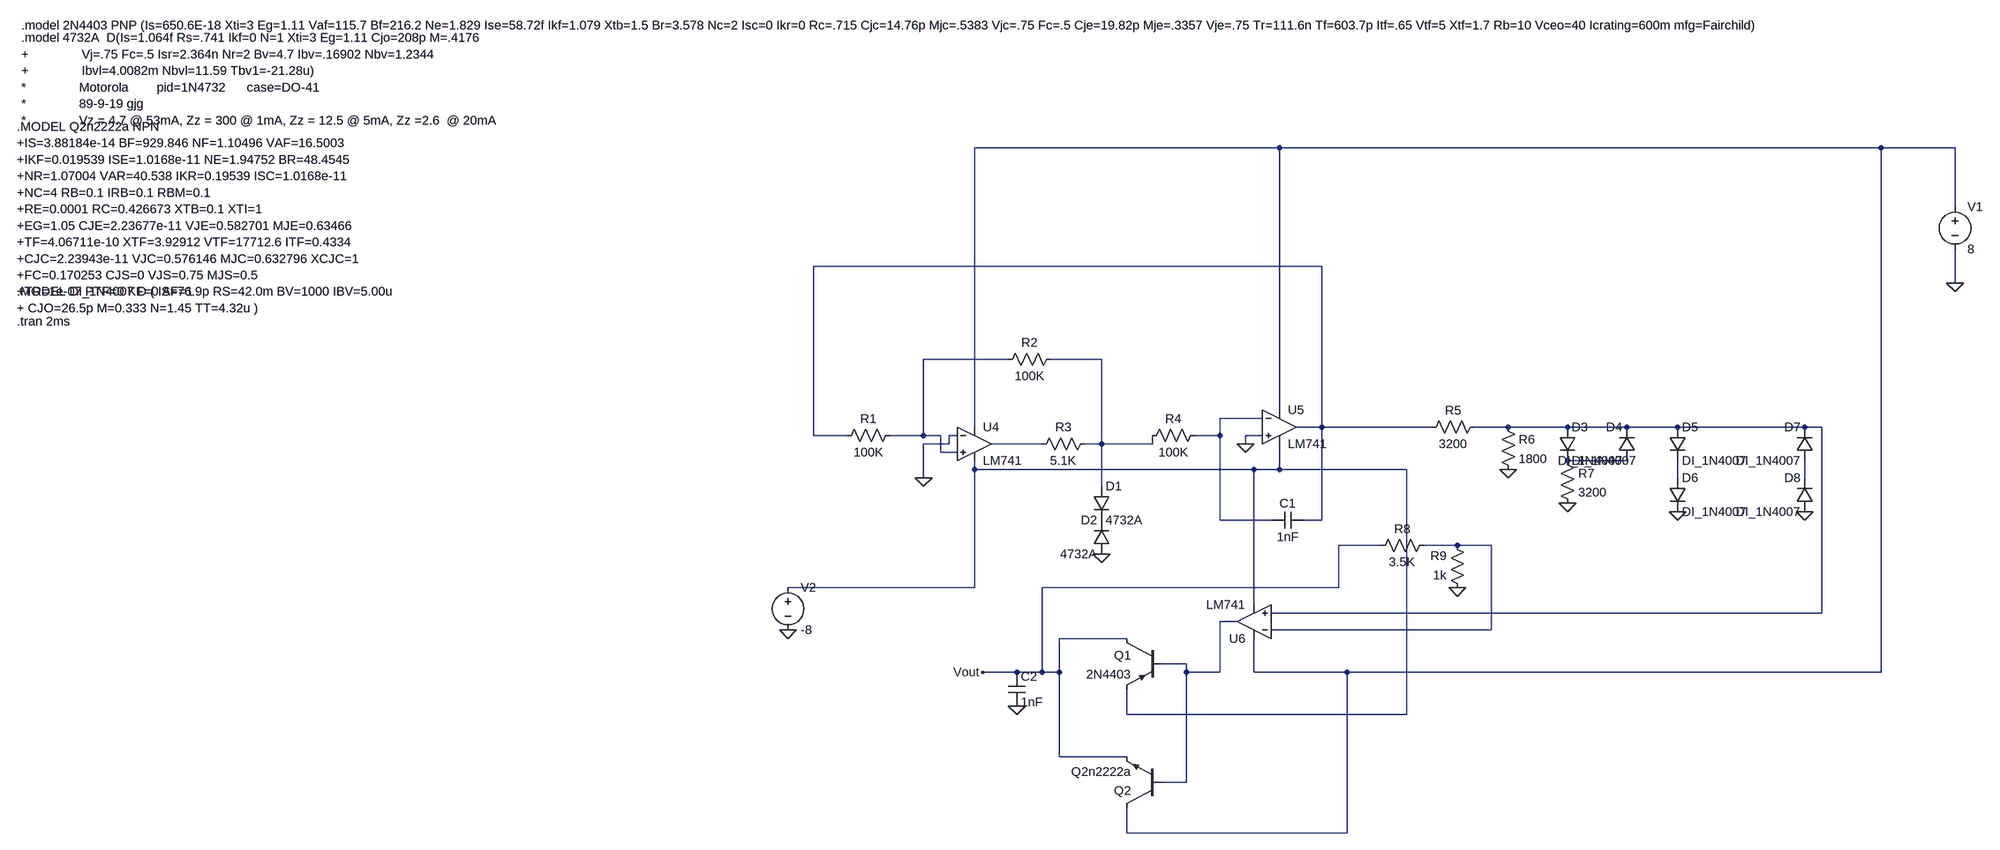
[diagram p0: schematic 24V-5VSine.asc]
24V-5VSine.asc, the LTspice schematic file:
Version 4.1
SHEET 1 3148 740
WIRE 720 -560 144 -560
WIRE 1936 -560 720 -560
WIRE 2224 -560 1936 -560
WIRE 2224 -448 2224 -560
WIRE 800 -336 -160 -336
WIRE 2224 -304 2224 -368
WIRE 208 -160 48 -160
WIRE 384 -160 288 -160
WIRE 720 -64 720 -560
WIRE 688 -48 608 -48
WIRE 144 -32 144 -560
WIRE 800 -32 800 -336
WIRE 800 -32 752 -32
WIRE 1008 -32 800 -32
WIRE 1152 -32 1088 -32
WIRE 1264 -32 1152 -32
WIRE 1376 -32 1264 -32
WIRE 1472 -32 1376 -32
WIRE 1712 -32 1472 -32
WIRE 1744 -32 1712 -32
WIRE -160 -16 -160 -336
WIRE -96 -16 -160 -16
WIRE 48 -16 48 -160
WIRE 48 -16 -16 -16
WIRE 80 -16 48 -16
WIRE 112 -16 96 -16
WIRE 608 -16 608 -48
WIRE 608 -16 560 -16
WIRE 688 -16 656 -16
WIRE 96 0 96 -16
WIRE 96 0 48 0
WIRE 272 0 176 0
WIRE 384 0 384 -160
WIRE 384 0 352 0
WIRE 480 0 480 -16
WIRE 480 0 384 0
WIRE 656 0 656 -16
WIRE 80 16 80 -16
WIRE 112 16 80 16
WIRE 1376 32 1264 32
WIRE 144 48 144 32
WIRE 672 48 144 48
WIRE 720 48 720 0
WIRE 720 48 672 48
WIRE 960 48 720 48
WIRE 48 64 48 0
WIRE 1472 64 1472 32
WIRE 1712 64 1712 32
WIRE 384 80 384 0
WIRE 608 144 608 -16
WIRE 704 144 608 144
WIRE 800 144 800 -32
WIRE 800 144 768 144
WIRE 912 192 832 192
WIRE 1056 192 992 192
WIRE 1120 192 1056 192
WIRE 144 272 144 48
WIRE 144 272 -208 272
WIRE 832 272 832 192
WIRE 832 272 272 272
WIRE 672 304 672 48
WIRE 1744 320 1744 -32
WIRE 1744 320 704 320
WIRE 640 336 608 336
WIRE 1120 352 1120 192
WIRE 1120 352 704 352
WIRE 432 368 304 368
WIRE 544 416 496 416
WIRE 224 432 160 432
WIRE 272 432 272 272
WIRE 272 432 224 432
WIRE 304 432 304 368
WIRE 304 432 272 432
WIRE 544 432 544 416
WIRE 608 432 608 336
WIRE 608 432 544 432
WIRE 672 432 672 368
WIRE 848 432 672 432
WIRE 1936 432 1936 -560
WIRE 1936 432 848 432
WIRE 432 512 432 464
WIRE 960 512 960 48
WIRE 960 512 432 512
WIRE 304 592 304 432
WIRE 432 592 304 592
WIRE 544 640 544 432
WIRE 544 640 496 640
WIRE 432 736 432 688
WIRE 848 736 848 432
WIRE 848 736 432 736
FLAG 48 64 0
FLAG 384 208 0
FLAG 1152 48 0
FLAG 1264 112 0
FLAG 1472 128 0
FLAG 1712 128 0
FLAG 1056 272 0
FLAG 224 496 0
FLAG 2224 -304 0
FLAG -208 352 0
FLAG 160 432 Vout
FLAG 656 0 0
SYMBOL res 0 -32 R90
WINDOW 0 0 56 VBottom 2
WINDOW 3 32 56 VTop 2
SYMATTR InstName R1
SYMATTR Value 100K
SYMATTR SpiceLine tol=1 pwr=0.1
SYMBOL res 304 -176 R90
WINDOW 0 0 56 VBottom 2
WINDOW 3 32 56 VTop 2
SYMATTR InstName R2
SYMATTR Value 100K
SYMATTR SpiceLine tol=1 pwr=0.1
SYMBOL res 368 -16 R90
WINDOW 0 0 56 VBottom 2
WINDOW 3 32 56 VTop 2
SYMATTR InstName R3
SYMATTR Value 5.1K
SYMATTR SpiceLine tol=1 pwr=0.1
SYMBOL res 576 -32 R90
WINDOW 0 0 56 VBottom 2
WINDOW 3 32 56 VTop 2
SYMATTR InstName R4
SYMATTR Value 100K
SYMATTR SpiceLine tol=1 pwr=0.1
SYMBOL cap 768 128 R90
WINDOW 0 0 32 VBottom 2
WINDOW 3 32 32 VTop 2
SYMATTR InstName C1
SYMATTR Value 1nF
SYMATTR SpiceLine V=50
SYMBOL res 1104 -48 R90
WINDOW 0 0 56 VBottom 2
WINDOW 3 32 56 VTop 2
SYMATTR InstName R5
SYMATTR Value 3200
SYMATTR SpiceLine tol=1 pwr=0.1
SYMBOL res 1136 -48 R0
SYMATTR InstName R6
SYMATTR Value 1800
SYMATTR SpiceLine tol=1 pwr=0.1
SYMBOL diode 1248 -32 R0
SYMATTR InstName D3
SYMATTR Value DI_1N4007
SYMBOL diode 1392 32 R180
WINDOW 0 24 64 Left 2
WINDOW 3 24 0 Left 2
SYMATTR InstName D4
SYMATTR Value DI_1N4007
SYMBOL res 1248 16 R0
SYMATTR InstName R7
SYMATTR Value 3200
SYMATTR SpiceLine tol=1 pwr=0.1
SYMBOL diode 1456 -32 R0
SYMATTR InstName D5
SYMATTR Value DI_1N4007
SYMBOL diode 1456 64 R0
SYMATTR InstName D6
SYMATTR Value DI_1N4007
SYMBOL diode 1728 32 R180
WINDOW 0 24 64 Left 2
WINDOW 3 24 0 Left 2
SYMATTR InstName D7
SYMATTR Value DI_1N4007
SYMBOL diode 1728 128 R180
WINDOW 0 24 64 Left 2
WINDOW 3 24 0 Left 2
SYMATTR InstName D8
SYMATTR Value DI_1N4007
SYMBOL res 1008 176 R90
WINDOW 0 0 56 VBottom 2
WINDOW 3 32 56 VTop 2
SYMATTR InstName R8
SYMATTR Value 3.5K
SYMBOL res 1072 288 R180
WINDOW 0 36 76 Left 2
WINDOW 3 36 40 Left 2
SYMATTR InstName R9
SYMATTR Value 1k
SYMBOL cap 208 432 R0
SYMATTR InstName C2
SYMATTR Value 1nF
SYMBOL pnp 496 368 M0
SYMATTR InstName Q1
SYMATTR Value 2N4403
SYMBOL npn 496 688 R180
SYMATTR InstName Q2
SYMATTR Value Q2n2222a
SYMBOL voltage 2224 -464 R0
WINDOW 123 0 0 Left 0
WINDOW 39 0 0 Left 0
SYMATTR InstName V1
SYMATTR Value 8
SYMBOL voltage -208 256 R0
WINDOW 123 0 0 Left 0
WINDOW 39 0 0 Left 0
SYMATTR InstName V2
SYMATTR Value -8
SYMBOL LM741 144 -64 R0
SYMATTR InstName U4
SYMBOL LM741 720 -96 R0
SYMATTR InstName U5
SYMBOL LM741 672 400 R180
SYMATTR InstName U6
SYMBOL diode 368 80 R0
SYMATTR InstName D1
SYMATTR Value 4732A
SYMBOL diode 400 208 R180
WINDOW 0 24 64 Left 2
WINDOW 3 24 0 Left 2
SYMATTR InstName D2
SYMATTR Value 4732A
TEXT -1664 -288 Left 2 !.MODEL DI_1N4007 D ( IS=76.9p RS=42.0m BV=1000 IBV=5.00u \n+ CJO=26.5p M=0.333 N=1.45 TT=4.32u )
TEXT -1656 -792 Left 2 !.model 2N4403 PNP (Is=650.6E-18 Xti=3 Eg=1.11 Vaf=115.7 Bf=216.2 Ne=1.829 Ise=58.72f Ikf=1.079 Xtb=1.5 Br=3.578 Nc=2 Isc=0 Ikr=0 Rc=.715 Cjc=14.76p Mjc=.5383 Vjc=.75 Fc=.5 Cje=19.82p Mje=.3357 Vje=.75 Tr=111.6n Tf=603.7p Itf=.65 Vtf=5 Xtf=1.7 Rb=10 Vceo=40 Icrating=600m mfg=Fairchild)
TEXT -1664 -600 Left 2 !.MODEL Q2n2222a NPN\n+IS=3.88184e-14 BF=929.846 NF=1.10496 VAF=16.5003\n+IKF=0.019539 ISE=1.0168e-11 NE=1.94752 BR=48.4545\n+NR=1.07004 VAR=40.538 IKR=0.19539 ISC=1.0168e-11\n+NC=4 RB=0.1 IRB=0.1 RBM=0.1\n+RE=0.0001 RC=0.426673 XTB=0.1 XTI=1\n+EG=1.05 CJE=2.23677e-11 VJE=0.582701 MJE=0.63466\n+TF=4.06711e-10 XTF=3.92912 VTF=17712.6 ITF=0.4334\n+CJC=2.23943e-11 VJC=0.576146 MJC=0.632796 XCJC=1\n+FC=0.170253 CJS=0 VJS=0.75 MJS=0.5\n+TR=1e-07 PTF=0 KF=0 AF=1
TEXT -1664 -232 Left 2 !.tran 2ms
TEXT -1656 -768 Left 2 !.model 4732A  D(Is=1.064f Rs=.741 Ikf=0 N=1 Xti=3 Eg=1.11 Cjo=208p M=.4176\n+               Vj=.75 Fc=.5 Isr=2.364n Nr=2 Bv=4.7 Ibv=.16902 Nbv=1.2344\n+               Ibvl=4.0082m Nbvl=11.59 Tbv1=-21.28u)\n*               Motorola        pid=1N4732      case=DO-41\n*               89-9-19 gjg\n*               Vz = 4.7 @ 53mA, Zz = 300 @ 1mA, Zz = 12.5 @ 5mA, Zz =2.6  @ 20mA

The netlist it stands for:
* 24V-5VSine.asc
R1 N003 N002 100K tol=1 pwr=0.1
R2 N004 N003 100K tol=1 pwr=0.1
R3 N004 N007 5.1K tol=1 pwr=0.1
R4 N005 N004 100K tol=1 pwr=0.1
C1 N002 N005 1nF V=50
R5 N006 N002 3200 tol=1 pwr=0.1
R6 N006 0 1800 tol=1 pwr=0.1
D3 N006 N008 DI_1N4007
D4 N008 N006 DI_1N4007
R7 N008 0 3200 tol=1 pwr=0.1
D5 N006 N010 DI_1N4007
D6 N010 0 DI_1N4007
D7 N011 N006 DI_1N4007
D8 0 N011 DI_1N4007
R8 N012 Vout 3.5K
R9 0 N012 1k
C2 Vout 0 1nF
Q1 Vout N013 N009 0 2N4403
Q2 N001 N013 Vout 0 Q2n2222a
V1 N001 0 8
V2 N009 0 -8
X§U4 N003 0 N001 N009 N007 LM741  ; pins In+ In- V+ V- OUT
X§U5 0 N005 N001 N009 N002 LM741  ; pins In+ In- V+ V- OUT
X§U6 N006 N012 N001 N009 N013 LM741  ; pins In+ In- V+ V- OUT
D1 N004 P001 4732A
D2 0 P001 4732A
.model D D
.lib standard.dio
.model NPN NPN
.model PNP PNP
.lib standard.bjt
.MODEL DI_1N4007 D ( IS=76.9p RS=42.0m BV=1000 IBV=5.00u
+ CJO=26.5p M=0.333 N=1.45 TT=4.32u )
.model 2N4403 PNP (Is=650.6E-18 Xti=3 Eg=1.11 Vaf=115.7 Bf=216.2 Ne=1.829 Ise=58.72f Ikf=1.079 Xtb=1.5 Br=3.578 Nc=2 Isc=0 Ikr=0 Rc=.715 Cjc=14.76p Mjc=.5383 Vjc=.75 Fc=.5 Cje=19.82p Mje=.3357 Vje=.75 Tr=111.6n Tf=603.7p Itf=.65 Vtf=5 Xtf=1.7 Rb=10 Vceo=40 Icrating=600m mfg=Fairchild)
.MODEL Q2n2222a NPN
+IS=3.88184e-14 BF=929.846 NF=1.10496 VAF=16.5003
+IKF=0.019539 ISE=1.0168e-11 NE=1.94752 BR=48.4545
+NR=1.07004 VAR=40.538 IKR=0.19539 ISC=1.0168e-11
+NC=4 RB=0.1 IRB=0.1 RBM=0.1
+RE=0.0001 RC=0.426673 XTB=0.1 XTI=1
+EG=1.05 CJE=2.23677e-11 VJE=0.582701 MJE=0.63466
+TF=4.06711e-10 XTF=3.92912 VTF=17712.6 ITF=0.4334
+CJC=2.23943e-11 VJC=0.576146 MJC=0.632796 XCJC=1
+FC=0.170253 CJS=0 VJS=0.75 MJS=0.5
+TR=1e-07 PTF=0 KF=0 AF=1
.tran 2ms
.model 4732A  D(Is=1.064f Rs=.741 Ikf=0 N=1 Xti=3 Eg=1.11 Cjo=208p M=.4176
+               Vj=.75 Fc=.5 Isr=2.364n Nr=2 Bv=4.7 Ibv=.16902 Nbv=1.2344
+               Ibvl=4.0082m Nbvl=11.59 Tbv1=-21.28u)
*               Motorola        pid=1N4732      case=DO-41
*               89-9-19 gjg
*               Vz = 4.7 @ 53mA, Zz = 300 @ 1mA, Zz = 12.5 @ 5mA, Zz =2.6  @ 20mA
.lib LM741.lib
.backanno
.end